# EAGLE design Adafruit BrainCraft HAT (EAGLE 9.6.2)

## Sheet 1 of 3: I2S Audio
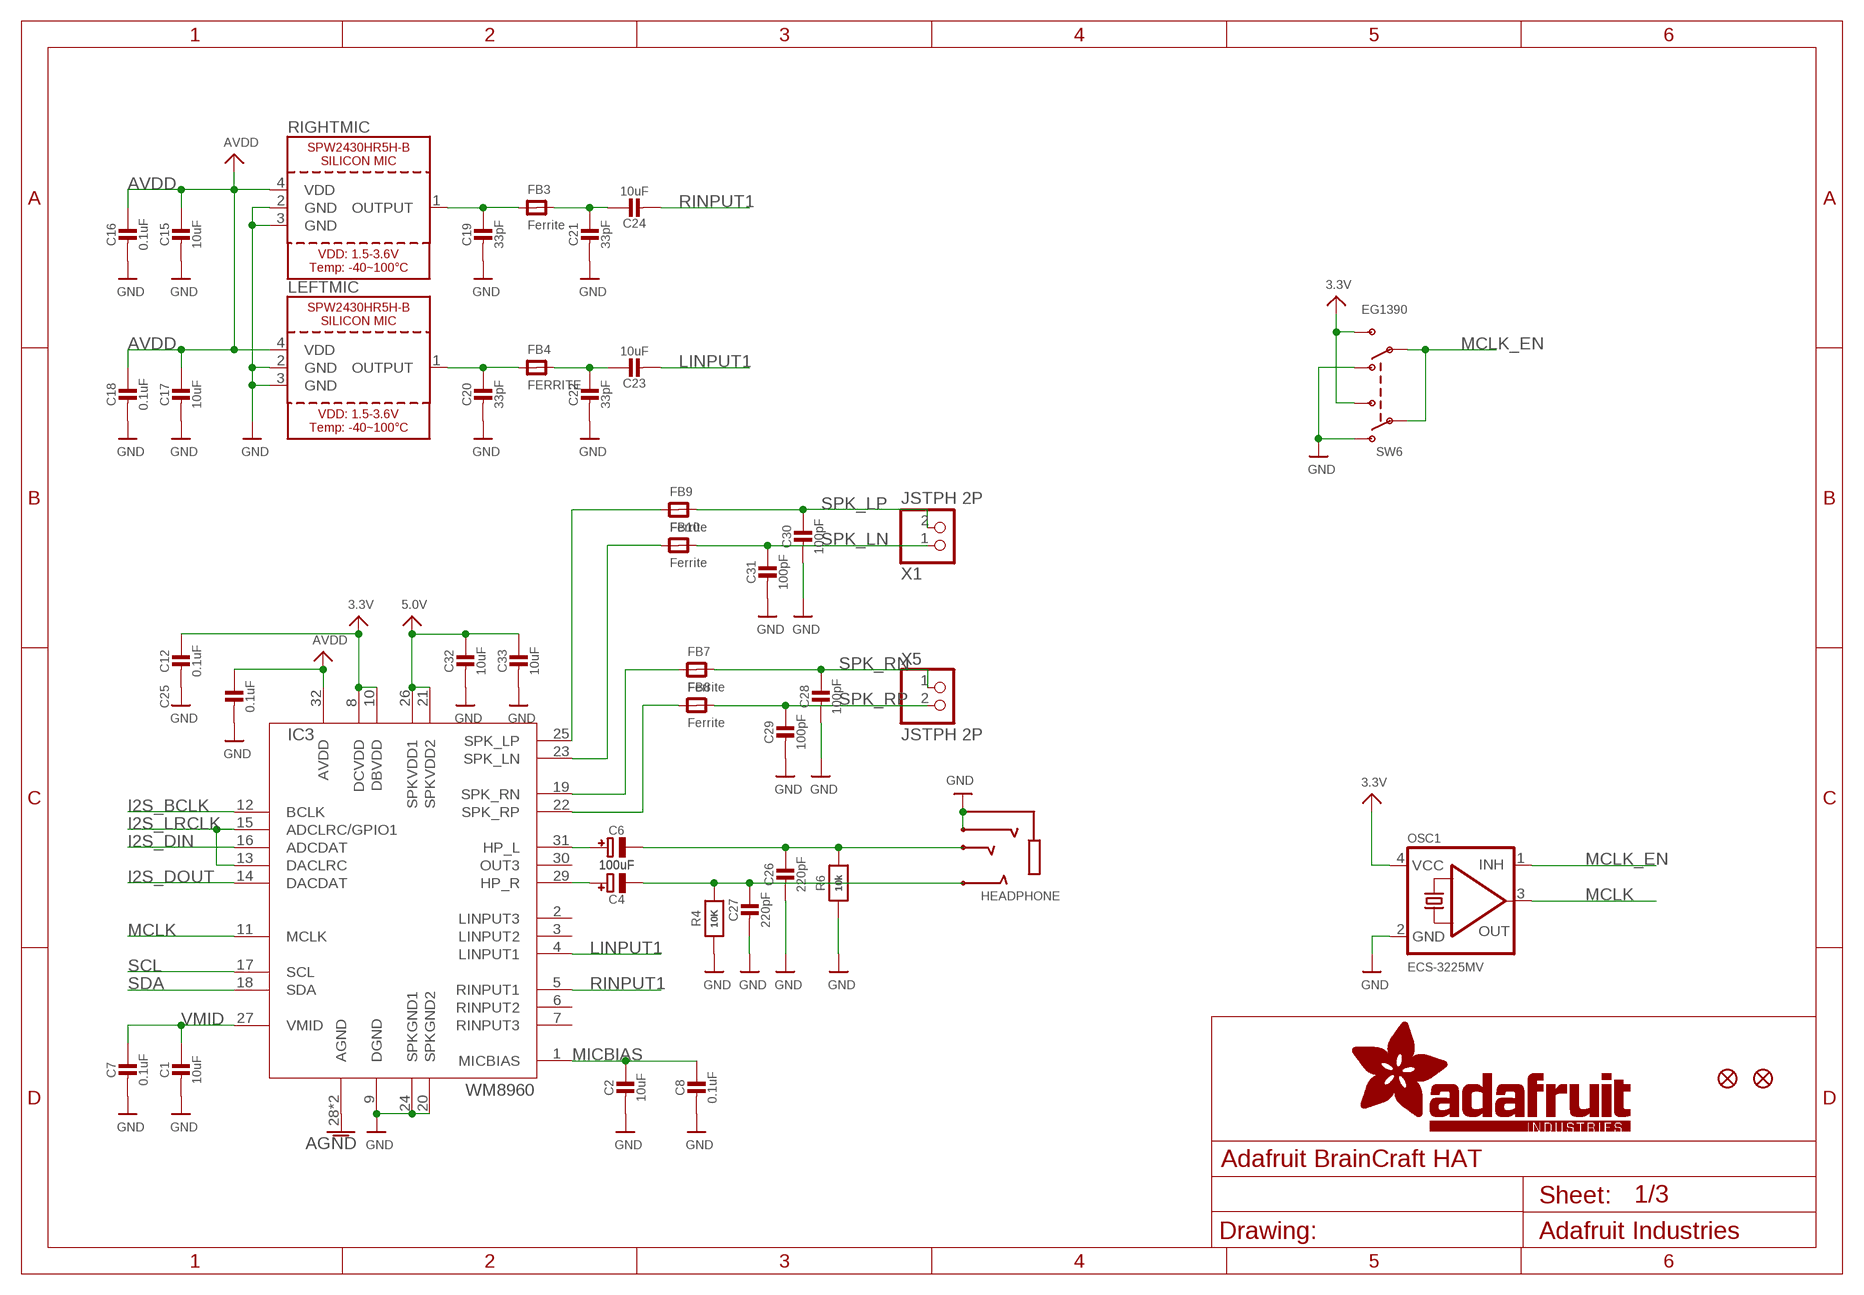
[diagram p0: schematic, sheet 1]

### Parts
C1  10uF  CAP_CERAMIC0805-NOOUTLINE  [0805-NO]
C2  10uF  CAP_CERAMIC0805-NOOUTLINE  [0805-NO]
C4  100uF  CAP_ELECTROLYTICPANASONIC_C  [PANASONIC_C]
C6  100uF  CAP_ELECTROLYTICPANASONIC_C  [PANASONIC_C]
C7  0.1uF  CAP_CERAMIC0603_NO  [0603-NO]
C8  0.1uF  CAP_CERAMIC0603_NO  [0603-NO]
C12  0.1uF  CAP_CERAMIC0603_NO  [0603-NO]
C15  10uF  CAP_CERAMIC0805-NOOUTLINE  [0805-NO]
C16  0.1uF  CAP_CERAMIC0603_NO  [0603-NO]
C17  10uF  CAP_CERAMIC0805-NOOUTLINE  [0805-NO]
C18  0.1uF  CAP_CERAMIC0603_NO  [0603-NO]
C19  33pF  CAP_CERAMIC0603_NO  [0603-NO]
C20  33pF  CAP_CERAMIC0603_NO  [0603-NO]
C21  33pF  CAP_CERAMIC0603_NO  [0603-NO]
C22  33pF  CAP_CERAMIC0603_NO  [0603-NO]
C23  10uF  CAP_CERAMIC0805-NOOUTLINE  [0805-NO]
C24  10uF  CAP_CERAMIC0805-NOOUTLINE  [0805-NO]
C25  0.1uF  CAP_CERAMIC0603_NO  [0603-NO]
C26  220pF  CAP_CERAMIC0603_NO  [0603-NO]
C27  220pF  CAP_CERAMIC0603_NO  [0603-NO]
C28  100pF  CAP_CERAMIC0603_NO  [0603-NO]
C29  100pF  CAP_CERAMIC0603_NO  [0603-NO]
C30  100pF  CAP_CERAMIC0603_NO  [0603-NO]
C31  100pF  CAP_CERAMIC0603_NO  [0603-NO]
C32  10uF  CAP_CERAMIC0805-NOOUTLINE  [0805-NO]
C33  10uF  CAP_CERAMIC0805-NOOUTLINE  [0805-NO]
FB3  Ferrite  FERRITE-0805NO  [0805-NO]
FB4  FERRITE  FERRITE-0805NO  [0805-NO]
FB7  Ferrite  FERRITE-0805NO  [0805-NO]
FB8  Ferrite  FERRITE-0805NO  [0805-NO]
FB9  Ferrite  FERRITE-0805NO  [0805-NO]
FB10  Ferrite  FERRITE-0805NO  [0805-NO]
FID1  FIDUCIAL_1MM  [FIDUCIAL_1MM]
FID2  FIDUCIAL_1MM  [FIDUCIAL_1MM]
HEADPHONE  AUDIO_3.5MMJACK_4POL  [4UCONN_18510]
IC3  WM8960  [QFN32_5MM]
LEFTMIC  SPW2430HR5H-B  [SPW2430HR5H-B]
OSC1  ECS-3225MV  OSCILLATOR3.2X2.5  [OSC_3.2X2.5MM]
R4  10K  RESISTOR_0603_NOOUT  [0603-NO]
R6  10k  RESISTOR_0603_NOOUT  [0603-NO]
RIGHTMIC  SPW2430HR5H-B  [SPW2430HR5H-B]
SW6  EG1390  SWITCH_DPDTEG1390  [EG1390]
X1  JSTPH 2P  CON_JST_PH_2PIN  [JSTPH2]
X5  JSTPH 2P  CON_JST_PH_2PIN  [JSTPH2]

### Nets
3.3V: C12.1 IC3.8(DCVDD) IC3.10(DBVDD) OSC1.4(VCC) SW6.S1 SW6.S2 ; also sheet 2,3
5.0V: C32.1 C33.1 IC3.21(SPKVDD2) IC3.26(SPKVDD1) ; also sheet 2,3
AGND: IC3.28(AGND) IC3.33(AGND) ; also sheet 3
AVDD: C15.1 C16.1 C17.1 C18.1 C25.1 IC3.32(AVDD) LEFTMIC.4(VDD) RIGHTMIC.4(VDD) ; also sheet 3
GND: C1.2 C2.2 C7.2 C8.2 C12.2 C15.2 C16.2 C17.2 C18.2 C19.2 C20.2 C21.2 C22.2 C25.2 C26.2 C27.2 C28.2 C29.2 C30.2 C31.2 C32.2 C33.2 HEADPHONE.1-GND(TIP) HEADPHONE.4-INNER_SLEEVE(RING1) IC3.9(DGND) IC3.20(SPKGND2) IC3.24(SPKGND1) LEFTMIC.2(GND) LEFTMIC.3(GND) OSC1.2(GND) R4.1 R6.1 RIGHTMIC.2(GND) RIGHTMIC.3(GND) SW6.O1 SW6.O2 ; also sheet 2,3
I2S_BCLK: IC3.12(BCLK) ; also sheet 3
I2S_DIN: IC3.16(ADCDAT) ; also sheet 3
I2S_DOUT: IC3.14(DACDAT) ; also sheet 3
I2S_LRCLK: IC3.13(DACLRC) IC3.15(ADCLRC/GPIO1) ; also sheet 3
LINPUT1: C23.2 IC3.4(LINPUT1)
MCLK: IC3.11(MCLK) OSC1.3(OUT)
MCLK_EN: OSC1.1(INH) SW6.P1 SW6.P2
MICBIAS: C2.1 C8.1 IC3.1(MICBIAS)
N$1: FB7.1 IC3.19(SPK_RN)
N$2: FB8.1 IC3.22(SPK_RP)
N$3: C6.+ IC3.31(HP_L)
N$5: C4.+ IC3.29(HP_R)
N$9: C4.- C27.1 HEADPHONE.3-OUTER_SLEEVE(RING2) R4.2
N$10: C6.- C26.1 HEADPHONE.2-TIP(RING3) R6.2
N$12: C19.1 FB3.1 RIGHTMIC.1(OUTPUT)
N$13: C20.1 FB4.1 LEFTMIC.1(OUTPUT)
N$16: C21.1 C24.1 FB3.2
N$17: C22.1 C23.1 FB4.2
N$21: FB9.1 IC3.25(SPK_LP)
N$22: FB10.1 IC3.23(SPK_LN)
RINPUT1: C24.2 IC3.5(RINPUT1)
SCL: IC3.17(SCL) ; also sheet 2,3
SDA: IC3.18(SDA) ; also sheet 2,3
SPK_LN: C31.1 FB10.2 X1.1
SPK_LP: C30.1 FB9.2 X1.2
SPK_RN: C28.1 FB7.2 X5.1
SPK_RP: C29.1 FB8.2 X5.2
VMID: C1.1 C7.1 IC3.27(VMID)
Unconnected: IC3.2(LINPUT3) IC3.3(LINPUT2) IC3.6(RINPUT2) IC3.7(RINPUT3) IC3.30(OUT3)

## Sheet 2 of 3: TFT Display and UI
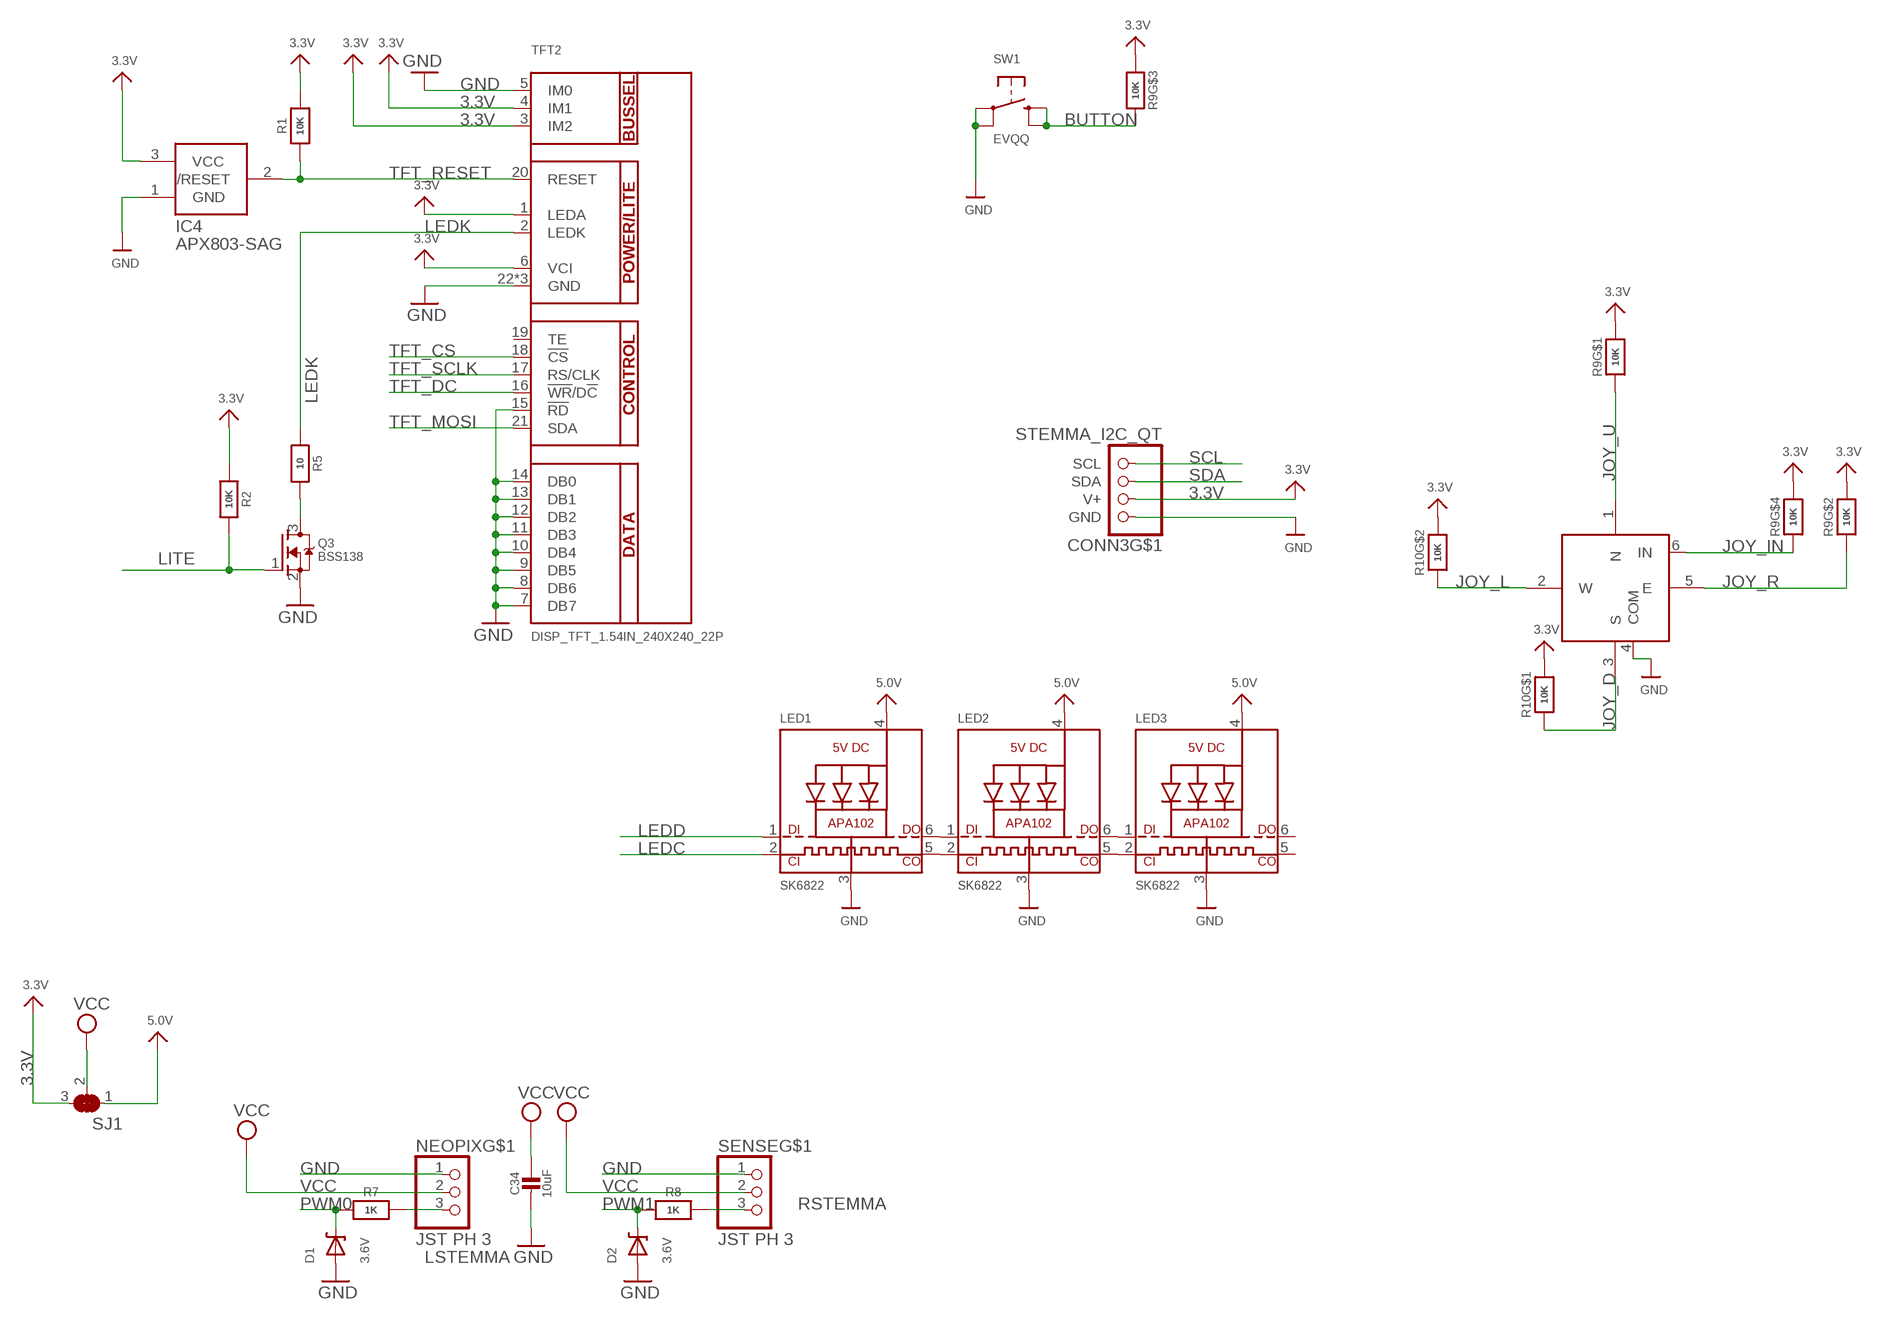
[diagram p1: schematic, sheet 2]

### Parts
C34  10uF  CAP_CERAMIC0805-NOOUTLINE  [0805-NO]
CONN3  STEMMA_I2C_QT  [JST_SH4]
D1  3.6V  DIODE-ZENERSOD323  [SOD-323]
D2  3.6V  DIODE-ZENERSOD323  [SOD-323]
IC4  APX803-SAG  AXP083-SAG  [SOT23]
LED1  SK6822  APA102  [APA102]
LED2  SK6822  APA102  [APA102]
LED3  SK6822  APA102  [APA102]
NEOPIX  JST PH 3  CON_JST_PH_3PIN  [JSTPH3]
Q3  BSS138  MOSFET-NWIDE  [SOT23-WIDE]
R1  10K  RESISTOR_0603_NOOUT  [0603-NO]
R2  10K  RESISTOR_0603_NOOUT  [0603-NO]
R5  10  RESISTOR_0603_NOOUT  [0603-NO]
R7  1K  RESISTOR_0603_NOOUT  [0603-NO]
R8  1K  RESISTOR_0603_NOOUT  [0603-NO]
R9  10K  RESISTOR_4PACK  [RESPACK_4X0603]
R10  10K  RESISTOR_4PACK  [RESPACK_4X0603]
SENSE  JST PH 3  CON_JST_PH_3PIN  [JSTPH3]
SJ1  SOLDERJUMPER_2WAY  [SOLDERJUMPER_2WAY_OPEN_NOPASTE]
SW1  EVQQ  SWITCH_TACT_SMT_EVQQ2_SMALL  [EVQ-Q2_SMALLER]
SW5  NAVSWITCHSKQUABAUE010  [SKQUBAE010]
TFT2  DISP_TFT_1.54IN_240X240_22P  [TFT_1.54IN_240X240_22PIN]

### Nets
3.3V: CONN3.2(V+) IC4.3(VCC) R1.2 R2.2 R9.5 R9.6 R9.7 R9.8 R10.7 R10.8 SJ1.3 TFT2.1(LEDA) TFT2.3(IM2) TFT2.4(IM1) TFT2.6(VCI) ; also sheet 1,3
5.0V: LED1.4(VDD) LED2.4(VDD) LED3.4(VDD) SJ1.1 ; also sheet 1,3
BUTTON: R9.3 SW1.B'(S1) SW1.B(S) ; also sheet 3
GND: C34.2 CONN3.1(GND) D1.A D2.A IC4.1(GND) LED1.3(GND) LED2.3(GND) LED3.3(GND) NEOPIX.1 Q3.2(S) SENSE.1 SW1.A'(P1) SW1.A(P) SW5.4(COM) TFT2.5(IM0) TFT2.7(DB7) TFT2.8(DB6) TFT2.9(DB5) TFT2.10(DB4) TFT2.11(DB3) TFT2.12(DB2) TFT2.13(DB1) TFT2.14(DB0) TFT2.15(!RD) TFT2.22(GND) TFT2.SUPPORT1(GND) TFT2.SUPPORT2(GND) ; also sheet 1,3
JOY_D: R10.1 SW5.3(S) ; also sheet 3
JOY_IN: R9.4 SW5.6(IN) ; also sheet 3
JOY_L: R10.2 SW5.2(W) ; also sheet 3
JOY_R: R9.2 SW5.5(E) ; also sheet 3
JOY_U: R9.1 SW5.1(N) ; also sheet 3
LEDC: LED1.2(CKI) ; also sheet 3
LEDD: LED1.1(DI) ; also sheet 3
LEDK: R5.2 TFT2.2(LEDK)
LITE: Q3.1(G) R2.1 ; also sheet 3
LSTEMMA: NEOPIX.3 R7.1
N$4: Q3.3(D) R5.1
N$7: LED1.6(DO) LED2.1(DI)
N$11: LED1.5(CKO) LED2.2(CKI)
N$14: LED2.6(DO) LED3.1(DI)
N$15: LED2.5(CKO) LED3.2(CKI)
PWM0: D1.C R7.2 ; also sheet 3
PWM1: D2.C R8.2 ; also sheet 3
RSTEMMA: R8.1 SENSE.3
SCL: CONN3.4(SCL) ; also sheet 1,3
SDA: CONN3.3(SDA) ; also sheet 1,3
TFT_CS: TFT2.18(!CS) ; also sheet 3
TFT_DC: TFT2.16(!WR!/D!C) ; also sheet 3
TFT_MOSI: TFT2.21(SDA) ; also sheet 3
TFT_RESET: IC4.2(/RESET) R1.1 TFT2.20(RESET)
TFT_SCLK: TFT2.17(RS/CLK) ; also sheet 3
VCC [power]: C34.1 NEOPIX.2 SENSE.2 SJ1.2
Unconnected: CONN3.MT1(MT) CONN3.MT2(MT) LED3.5(CKO) LED3.6(DO) NEOPIX.NC1(MT) NEOPIX.NC2(MT) R10.3 R10.4 R10.5 R10.6 SENSE.NC1(MT) SENSE.NC2(MT) TFT2.19(TE)

## Sheet 3 of 3: RasPi Hat & Power
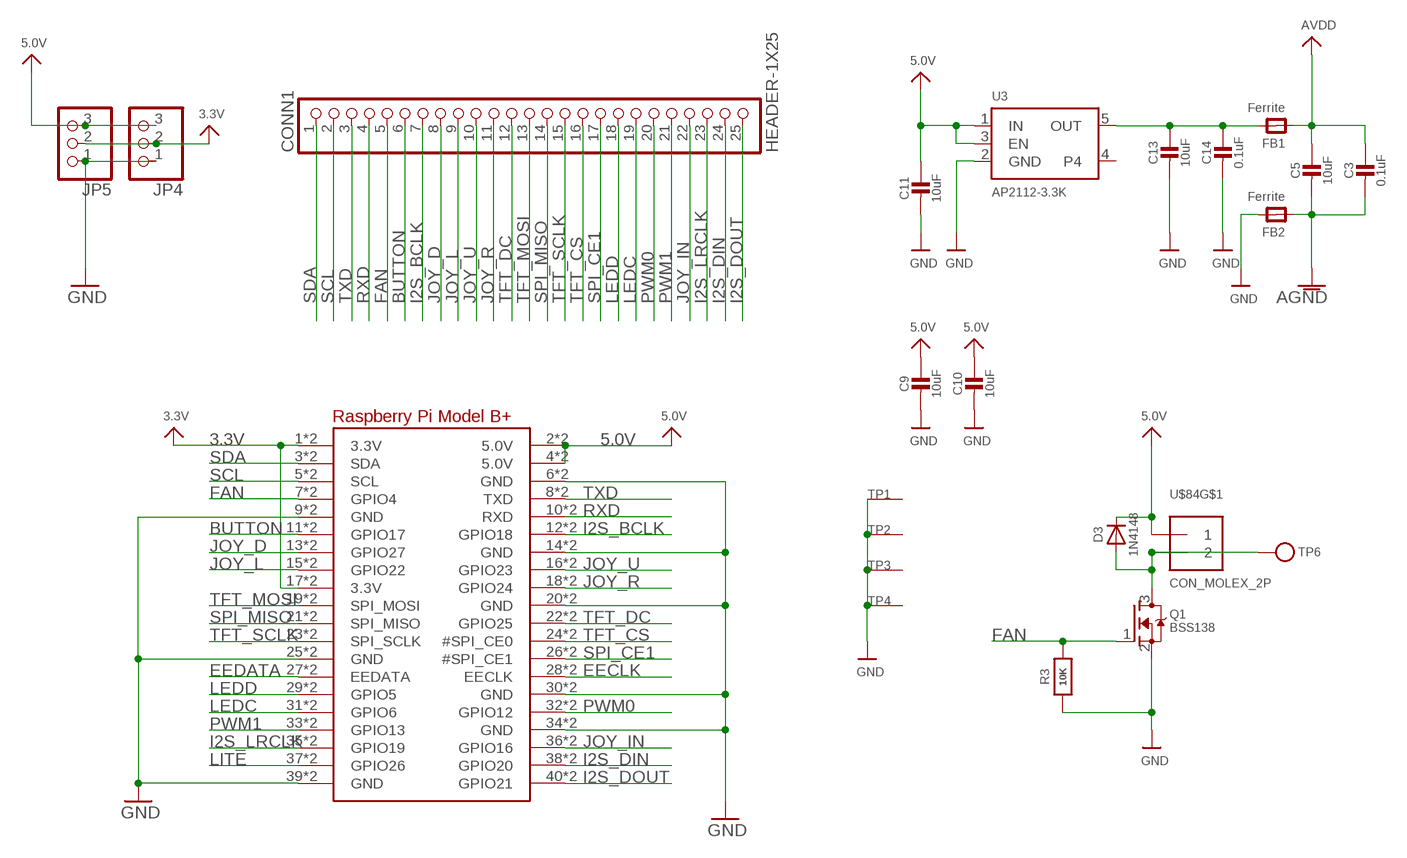
[diagram p2: schematic, sheet 3]

### Parts
C3  0.1uF  CAP_CERAMIC0603_NO  [0603-NO]
C5  10uF  CAP_CERAMIC0805-NOOUTLINE  [0805-NO]
C9  10uF  CAP_CERAMIC0805-NOOUTLINE  [0805-NO]
C10  10uF  CAP_CERAMIC0805-NOOUTLINE  [0805-NO]
C11  10uF  CAP_CERAMIC0805-NOOUTLINE  [0805-NO]
C13  10uF  CAP_CERAMIC0805-NOOUTLINE  [0805-NO]
C14  0.1uF  CAP_CERAMIC0603_NO  [0603-NO]
CONN1  HEADER-1X25  [1X25_ROUND_70MIL]
D3  1N4148  DIODESOD-323  [SOD-323]
FB1  Ferrite  FERRITE0805  [0805]
FB2  Ferrite  FERRITE0805  [0805]
JP4  HEADER-1X376MIL  [1X03_ROUND_76]
JP5  HEADER-1X376MIL  [1X03_ROUND_76]
Q1  BSS138  MOSFET-NWIDE  [SOT23-WIDE]
R3  10K  RESISTOR_0603_NOOUT  [0603-NO]
RPI1  RASPBERRYPI_BPLUS_HAT_SMTTHM_SLOTS  [PI_HAT_SMTTHM_SLOTS]
TP1  SEWTAP_SMTNUTM3  [SMT_NUT_3MM]
TP2  SEWTAP_SMTNUTM3  [SMT_NUT_3MM]
TP3  SEWTAP_SMTNUTM3  [SMT_NUT_3MM]
TP4  SEWTAP_SMTNUTM3  [SMT_NUT_3MM]
TP6  TESTPOINTROUND2MM  [TESTPOINT_ROUND_2MM]
U3  AP2112-3.3K  VREG_SOT23-5  [SOT23-5]
U$84  CON_MOLEX_2P  [53398-0271]

### Nets
3.3V: JP4.2 JP5.2 RPI1.1(3.3V) RPI1.17(3.3V) RPI1.S1(3.3V) RPI1.S17(3.3V) ; also sheet 1,2
5.0V: C9.1 C10.1 C11.1 D3.C JP4.3 JP5.3 RPI1.2(5.0V) RPI1.4(5.0V) RPI1.S2(5.0V) RPI1.S4(5.0V) U3.1(IN) U3.3(EN) U$84.1 ; also sheet 1,2
AGND: C3.2 C5.2 FB2.1 ; also sheet 1
AVDD: C3.1 C5.1 FB1.1 ; also sheet 1
BUTTON: CONN1.6 RPI1.11(GPIO17) RPI1.S11(GPIO17) ; also sheet 2
EECLK: RPI1.28(EECLK) RPI1.S28(EECLK)
EEDATA: RPI1.27(EEDATA) RPI1.S27(EEDATA)
FAN: CONN1.5 Q1.1(G) R3.1 RPI1.7(GPIO4) RPI1.S7(GPIO4)
GND: C9.2 C10.2 C11.2 C13.2 C14.2 FB2.2 JP4.1 JP5.1 Q1.2(S) R3.2 RPI1.6(GND) RPI1.9(GND) RPI1.14(GND) RPI1.20(GND) RPI1.25(GND) RPI1.30(GND) RPI1.34(GND) RPI1.39(GND) RPI1.S6(GND) RPI1.S9(GND) RPI1.S14(GND) RPI1.S20(GND) RPI1.S25(GND) RPI1.S30(GND) RPI1.S34(GND) RPI1.S39(GND) TP1.P$1(SEW) TP2.P$1(SEW) TP3.P$1(SEW) TP4.P$1(SEW) U3.2(GND) ; also sheet 1,2
I2S_BCLK: CONN1.7 RPI1.12(GPIO18) RPI1.S12(GPIO18) ; also sheet 1
I2S_DIN: CONN1.24 RPI1.38(GPIO20) RPI1.S38(GPIO20) ; also sheet 1
I2S_DOUT: CONN1.25 RPI1.40(GPIO21) RPI1.S40(GPIO21) ; also sheet 1
I2S_LRCLK: CONN1.23 RPI1.35(GPIO19) RPI1.S35(GPIO19) ; also sheet 1
JOY_D: CONN1.8 RPI1.13(GPIO27) RPI1.S13(GPIO27) ; also sheet 2
JOY_IN: CONN1.22 RPI1.36(GPIO16) RPI1.S36(GPIO16) ; also sheet 2
JOY_L: CONN1.9 RPI1.15(GPIO22) RPI1.S15(GPIO22) ; also sheet 2
JOY_R: CONN1.11 RPI1.18(GPIO24) RPI1.S18(GPIO24) ; also sheet 2
JOY_U: CONN1.10 RPI1.16(GPIO23) RPI1.S16(GPIO23) ; also sheet 2
LEDC: CONN1.19 RPI1.31(GPIO6) RPI1.S31(GPIO6) ; also sheet 2
LEDD: CONN1.18 RPI1.29(GPIO5) RPI1.S29(GPIO5) ; also sheet 2
LITE: RPI1.37(GPIO26) RPI1.S37(GPIO26) ; also sheet 2
N$19: D3.A Q1.3(D) TP6.P$1 U$84.2
OUT: C13.1 C14.1 FB1.2 U3.5(OUT)
PWM0: CONN1.20 RPI1.32(GPIO12) RPI1.S32(GPIO12) ; also sheet 2
PWM1: CONN1.21 RPI1.33(GPIO13) RPI1.S33(GPIO13) ; also sheet 2
RXD: CONN1.4 RPI1.10(RXD) RPI1.S10(RXD)
SCL: CONN1.2 RPI1.5(SCL) RPI1.S5(SCL) ; also sheet 1,2
SDA: CONN1.1 RPI1.3(SDA) RPI1.S3(SDA) ; also sheet 1,2
SPI_CE1: CONN1.17 RPI1.26(#SPI_CE1) RPI1.S26(#SPI_CE1)
SPI_MISO: CONN1.14 RPI1.21(SPI_MISO) RPI1.S21(SPI_MISO)
TFT_CS: CONN1.16 RPI1.24(#SPI_CE0) RPI1.S24(#SPI_CE0) ; also sheet 2
TFT_DC: CONN1.12 RPI1.22(GPIO25) RPI1.S22(GPIO25) ; also sheet 2
TFT_MOSI: CONN1.13 RPI1.19(SPI_MOSI) RPI1.S19(SPI_MOSI) ; also sheet 2
TFT_SCLK: CONN1.15 RPI1.23(SPI_SCLK) RPI1.S23(SPI_SCLK) ; also sheet 2
TXD: CONN1.3 RPI1.8(TXD) RPI1.S8(TXD)
Unconnected: U3.4 U$84.M1(MT) U$84.M2(MT)

## Library data of the parts
C1-C3 C5 C7-C34 = microbuilder:CAP_CERAMIC: Ceramic Capacitors For new designs, use the packages preceded by an '_' character since they are more reliable: The following footprints should be used on most boards: _0402 - Standard footprint for regular board layouts _0603 - Standard footprint for regular board layouts _0805 - Standard footprint for regular board layouts _1206 - Standard footprint for regular board layouts For extremely tight-pitch boards where space is at a premium, the following 'micro-pitch' footprints can be used (smaller pads, no silkscreen outline, etc.): _0402MP - Micro-pitch footprint for very dense/compact boards _0603MP - Micro-pitch footprint for very dense/compact boards _0805MP - Micro-pitch footprint for very dense/compact boards _1206MP - Micro-pitch footprint for very dense/compact boards
C4 C6 = microbuilder:CAP_ELECTROLYTIC: Electrolytic Capacitors SMT PANASONIC_C - Size C Panasonic Electrolytic Aluminum Capacitor 47µF 16V 20% Electrolytic Capacitor [Digikey: PCE3890TR-ND] PANASONIC_D - Size D Panasonic Electrolytic Aluminum Capacitor 100µF 25V 20% Electrolytic Capacitor [Digikey: PCE3898TR-ND] PTH 3.5 mm grid, 8 mm diameter ... 3.5 mm grid, 10 mm diameter ...
CONN1 = microbuilder:HEADER-1X25
CONN3 = microbuilder:STEMMA_I2C
D1 D2 = microbuilder:DIODE-ZENER: Zener Diode SMA: 30V 1W Zener Diode, 1.2Vf - Digikey: SMAZ30-FDICT-ND
D3 = microbuilder:DIODE: Diode SMA Model Volts Amps Type Vf Ir Digikey # Notes SSA34-E3 40V 3A Schottky 480mV @ 3A 200uA @ 40V SSA34-E3/61TGITR-ND CDBA120-G 20V 1A Schottky 500mV @ 1A 500uA @ 20V 641-1014-6-ND REEL MBRA210 10V 2A Schottky 350mV @ 2A 700uA @ 10V MBRA210LT3 SOD-123 Model Volts Amps Type Vf Ir Order # Notes BAT54T1G 30V 200mA Schottky 800mV @ 200mA 2uA @ 25V BAT54T1GOSTR-ND B0530W 30V 500mA Schottky 430mV @ 500mA 130uA @ 30V B0530W-FDICT-ND REEL MBR120 20V 1A Schottky 340mV @ 1A MBR120VLSFT1GOSCT-ND SOD-323 Model Volts Amps Type Vf Ir Order # Notes PMEG2005EJ 20V 500mA Schottky 355mV @ 500mA 568-4110-1-ND ZLLS410 10V 570mA Schottky 380mV @ 570mA ZLLS410CT-ND 1N4148WS 75V 150mA Silicon/Simple 1V 1N4148WSFSCT-ND REEL SOD-523 Model Volts Amps Type Vf Ir Order # Notes BAT54XV2 30V 200mA Schottky 0.8V @ 100mA BAT54XV2CT-ND TB751S 30V 30mA Schottky RB751S-40TE61CT-ND SOT23-R/W (R = Solder Paste/Reflow Ovens, W = Hand-Soldering) Model Volts Amps Type Vf Ir Order # Notes BAT54FILM 40V 300mA Schottky 497-7162-1-ND POWERDI-5 Model Volts Amps Type Vf Ir Order # Notes PDS560 60V 5A Schottky 670mV @ 5A 150uA @ 60V PDS560DICT-ND
FB1-FB4 FB7-FB10 = microbuilder:FERRITE: Ferrite Bead 0603 MMZ1608B121C - 120 Ohm @ 100MHz, 600mA, 0.15 Ohm DC Resistance - Digikey: 445-2164-1-ND BK1608HW121-T - 120 Ohm, 600mA Ferrite Chip - Digikey: 587-1876-2-ND 0805 HZ0805B272R-10 - 2.7K Ohm @ 100MHz, 200mA, 0.8 Ohm DC Resistance - Digikey: 240-2504-1-ND (see also Murata BLM21BD272SN1L) MMZ2012Y152B - 1.5K Ohm @ 100MHz, 500mA, 0.4 Ohm DC Resistance - Digikey: 445-1560-1-ND - Mainly for high frequency (80-400MHz) MMZ2012R102A - 1K Ohm @ 100MHz, 500mA, 0.3 Ohm DC Resistance - Digikey: 445-1555-2-ND - More general purpose (10-200MHz)
FID1 FID2 = microbuilder:FIDUCIAL: Fiducial Alignment Points Various fiducial points for machine vision alignment.; BOM: EXCLUDE
HEADPHONE = microbuilder:AUDIO_3.5MMJACK_4POL: Footprint courtesy Morten Hjerde (Riftlabs.com) These are normally connected as follows (4-pin 3.5mm 'TRRS'), from left-to right on the schematic symbol above: Tip: Left Audio Outermost Ring: Right Audio Innermost Ring: Common/GND Shell: Mic+
IC3 = microbuilder:WM8960
IC4 = adafruit:AXP083
JP4 JP5 = microbuilder:HEADER-1X3: PIN HEADER
LED1-LED3 = microbuilder:APA102: APA102/DotStar Pixels VCC: 5V DC Refresh Rate: 400Hz
LEFTMIC RIGHTMIC = microbuilder:SPW2430HR5H-B: SPW2430HR5H-B - Silicon Microphone
NEOPIX SENSE = microbuilder:CON_JST_PH_3PIN
OSC1 = microbuilder:OSCILLATOR: Oscillators 3.2x2.5mm SMT 4.0MHz +/- 50ppm, 3.3V, 9mA, -40/+85°C - Digikey: 535-9752-1-ND 50MHz +/- 50ppm, 3.3V, 8mA, -10/+70°C - Digikey: 478-4792-1-ND 5x7mm SMT 4.0MHz +/-20ppm 3.3V, 20mA, -20/+70°C - Digikey: 535-9329-2-ND 50MHz +/- 25ppm 3.3V, 35mA, -40/+85°C - Digikey: 631-1197-1-ND
Q1 Q3 = microbuilder:MOSFET-N: N-Channel Mosfet LEGEND VDS: Voltage Drain-Source ID: Drain Current RDS(ON): Drain-Source On-State Resistance VGS(TH): Gate-Source Threshold Voltage CISS: Drain-Source Input Capacitance SOT-23 Name VDS ID RDS(ON) VGS(TH) CISS Order Number 2N7002E 60V 260mA 2.5 Ohm 2.5V @ 250uA 26.7pF @ 25V 2N7002ET1GOSTR-ND BSH103 30V 850mA 400 mOhm 400mV @ 1mA 83pF @ 24V BSH103,235-ND BSS138 60V 320mA 1.6 Ohm 1.5V @ 250uA 50pF @ 10V Mouser: 771-BSS138PW115 DMN2075U-7 20V 4.2A 38 mOhm 1V @ 250 uA 594.3pF @ 10V DMN2075U-7DICT-ND * BSS138 good choice for I2C level-shifting POWERPAK 1212-8 Name VDS ID RDS(ON) VGS(TH) CISS Order Number Si7308DN 60V 6A 58 mOhm 3V @ 250uA 665pF @ 15V SI7308DN-T1-E3CT-ND
R1-R8 = microbuilder:RESISTOR: Resistors For new designs, use the packages preceded by an '_' character since they are more reliable: The following footprints should be used on most boards: _0402 - Standard footprint for regular board layouts _0603 - Standard footprint for regular board layouts _0805 - Standard footprint for regular board layouts _1206 - Standard footprint for regular board layouts For extremely tight-pitch boards where space is at a premium, the following 'micro-pitch' footprints can be used (smaller pads, no silkscreen outline, etc.): _0402MP - Micro-pitch footprint for very dense/compact boards _0603MP - Micro-pitch footprint for very dense/compact boards _0805MP - Micro-pitch footprint for very dense/compact boards _1206MP - Micro-pitch footprint for very dense/compact boards
R9 R10 = microbuilder:RESISTOR_4PACK: Resistor Packs (4 resistors) 4 x 0603 10K 1/16W - Digikey: YC164J-10KCT-ND
RPI1 = adafruit_sbc:RASPBERRYPI_BPLUS
SJ1 = microbuilder:SOLDERJUMPER_2WAY: 2-Way Solder Jumper
SW1 = microbuilder:SWITCH_TACT_SMT: SMT Tact Switches 6x6mm - Digikey: P12940SCT-ND KMR2 (4.6x2.8mm) - Digikey: 401-1426-1-ND EVQ-PQHB55 - Light Touch, 160GF (4.5x4.5mm) - Digikey: P8090SCT-ND KMT0 - KMT021 NGJ LHS (etc.) IP68/Waterproof - Digikey: CKN10289CT-ND
SW5 = microbuilder:NAVSWITCH
SW6 = microbuilder:SWITCH_DPDT: Switch - DPDT A DPDT Switch acts like an SPDT switch, but has a pair of switches instead of just one. Vertical - 0.3A @ 6V SMT - Digikey: JS202011SCQN
TFT2 = adafruit_display:DISP_TFT_1.54IN_240X240_22P
TP1-TP4 = microbuilder:SEWTAP
TP6 = microbuilder:TESTPOINT: Test Point Various test points for characterisation and PCB testing TESTPOINT_SMT - Compact Surface Mount Test Point [Digikey: 5016KTR-ND]
U3 = microbuilder:VREG_SOT23-5: SOT23-5 Fixed Voltage Regulators Part Current Out V Out V In V Dropout θJA (°C/W) TJ (°C) Digikey Part No. ADP121 150mA 3.3V 3.4-5.5V 0.09V @ 150mA -- -- ADP121-AUJZ33R7CT-ND ADP121 150mA 3.0V 3.1-5.5V 0.09V @ 150mA -- -- ADP121-AUJZ30R7CT-ND ADP122 300mA 3.3V 3.4-5.5V 0.085V @ 300mA -- -- ADP122AUJZ-3.3-R7CT-ND ADP1712 300mA 3.3V 3.5-5.5V 0.17V @ 300mA -- -- ADP1712AUJZ-3.3-R7TR-ND AP7311 (Low Cost) 150mA 3.3V 3.5-6V 0.15V @ 150mA -- -- AP7311-33WG-7DICT-ND LD39015M18R 150mA 1.8V 1.9V-5.5V 0.08V @ 100mA -- -- 497-6977-1-ND LP2985A-33DBVR 150mA 3.3V 3.3-16V 0.28V @ 150mA 206 150 296-18479-1-ND MCP1824T-3302E/OT 300mA 3.3V 3.5V-6V 0.2V @ 300mA -- -- MCP1824T-3302E/OTCT-ND MIC5205-2.5YM5 TR 150mA 2.5V 2.7-16V 0.165V @ 150mA -- -- 576-1257-2-ND MIC5205-3.0YM5 TR 150mA 3.0V 3.2V-16V 0.165V @ 150mA -- -- 576-1258-2-ND MIC5205-3.3YM5 TR 150mA 3.3V 3.5V-16V 0.165V @ 150mA -- -- 576-1259-2-ND TPS780330220 150mA 3.3V+2.2V 3.6-5.5V 250mV Max -- -- 296-23332-1-ND TDA3663/N1,135 100mA 3.3V 3.5-45V 0.18V @ 50mA -- -- 568-5343-1-ND Max operating temp can be calculated using θJA, TJ (max junction temperature), and power in watts. Set the "Maximum Ambient Temperature" until it reaches TJ ("Max Junction Temperature"), which is the absolute limit for safe use of the regulator: Heat Sink Temperature Calculator <http://www.daycounter.com/Calculators/Heat-Sink-Temperature-Calculator.phtml> For example, With 12V source into a 3.3V LP2985 and a 30mA load, we are dissipating (12V-3.3V) * 0.03A = 0.261W. With a θJA of 206 °C/W, a TJ of 150°C, and 261mW we can safely use the chip without a heat sink up to 75°C (=147.1°C Junction Temperature).
U$84 = microbuilder:CON_MOLEX_2P
X1 X5 = microbuilder:CON_JST_PH_2PIN: JST 2-Pin Right-Angle Connector PH-Series - 4UConnector: 17311 SH-Series - 4UConnector: 07278

## Net classes
1 power: width 0.305 mm

## Board
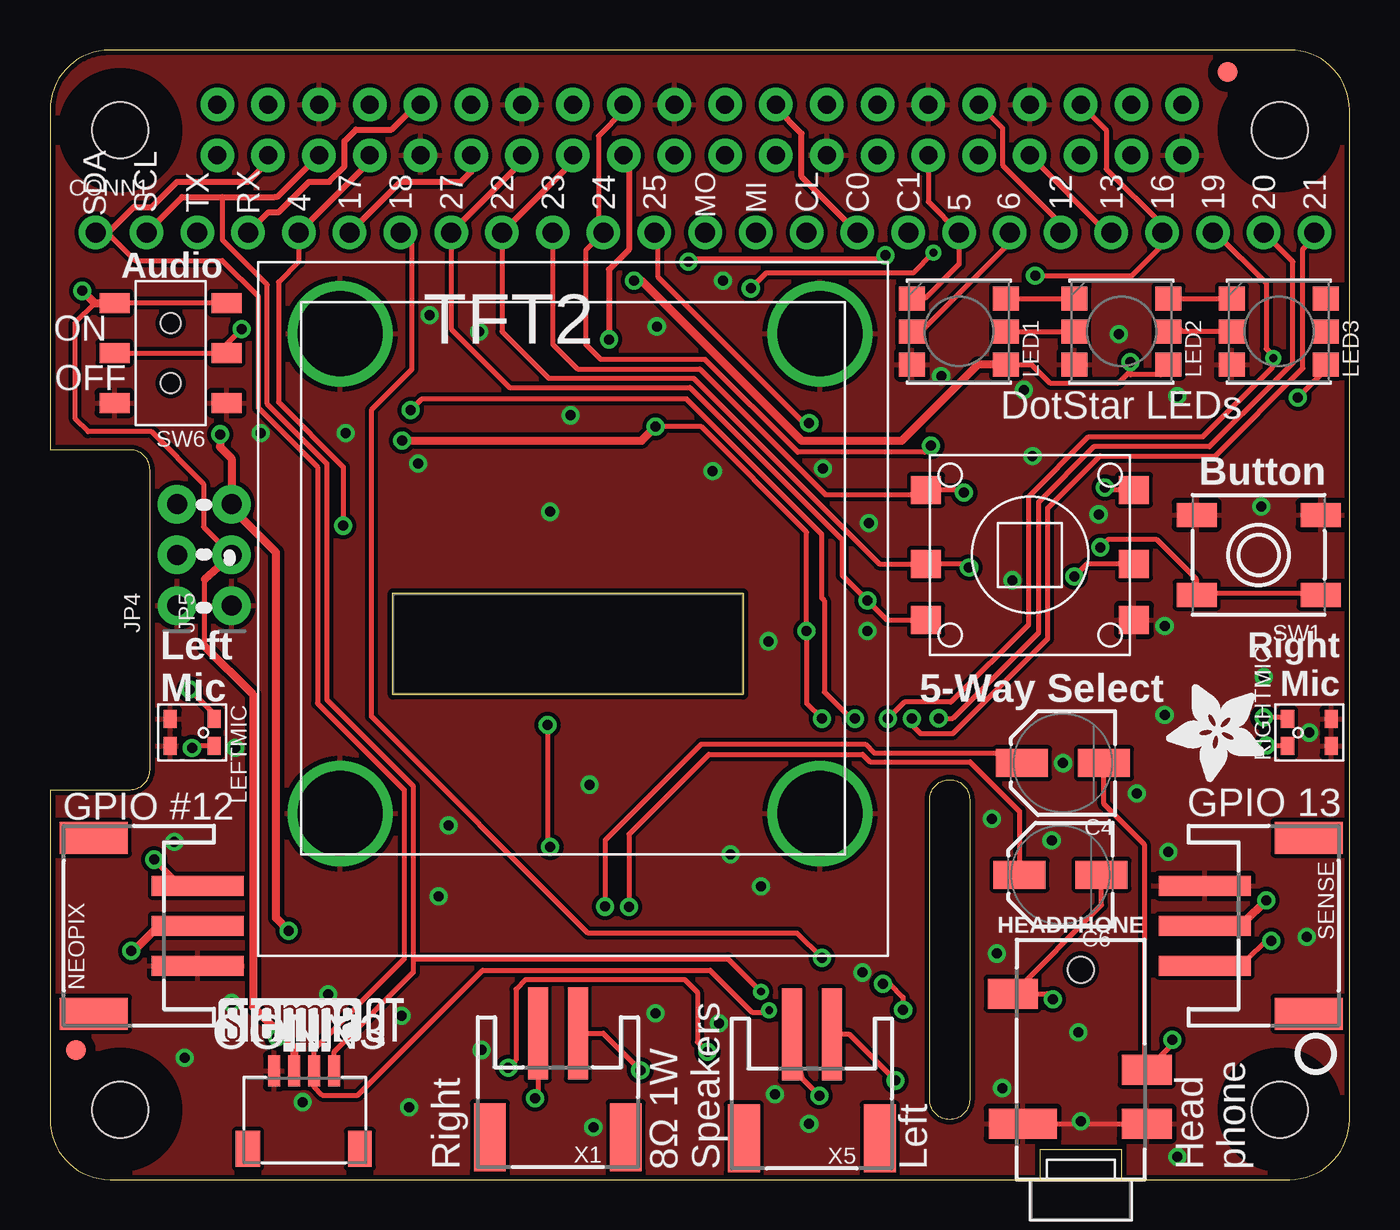
[diagram p3: board, top side]
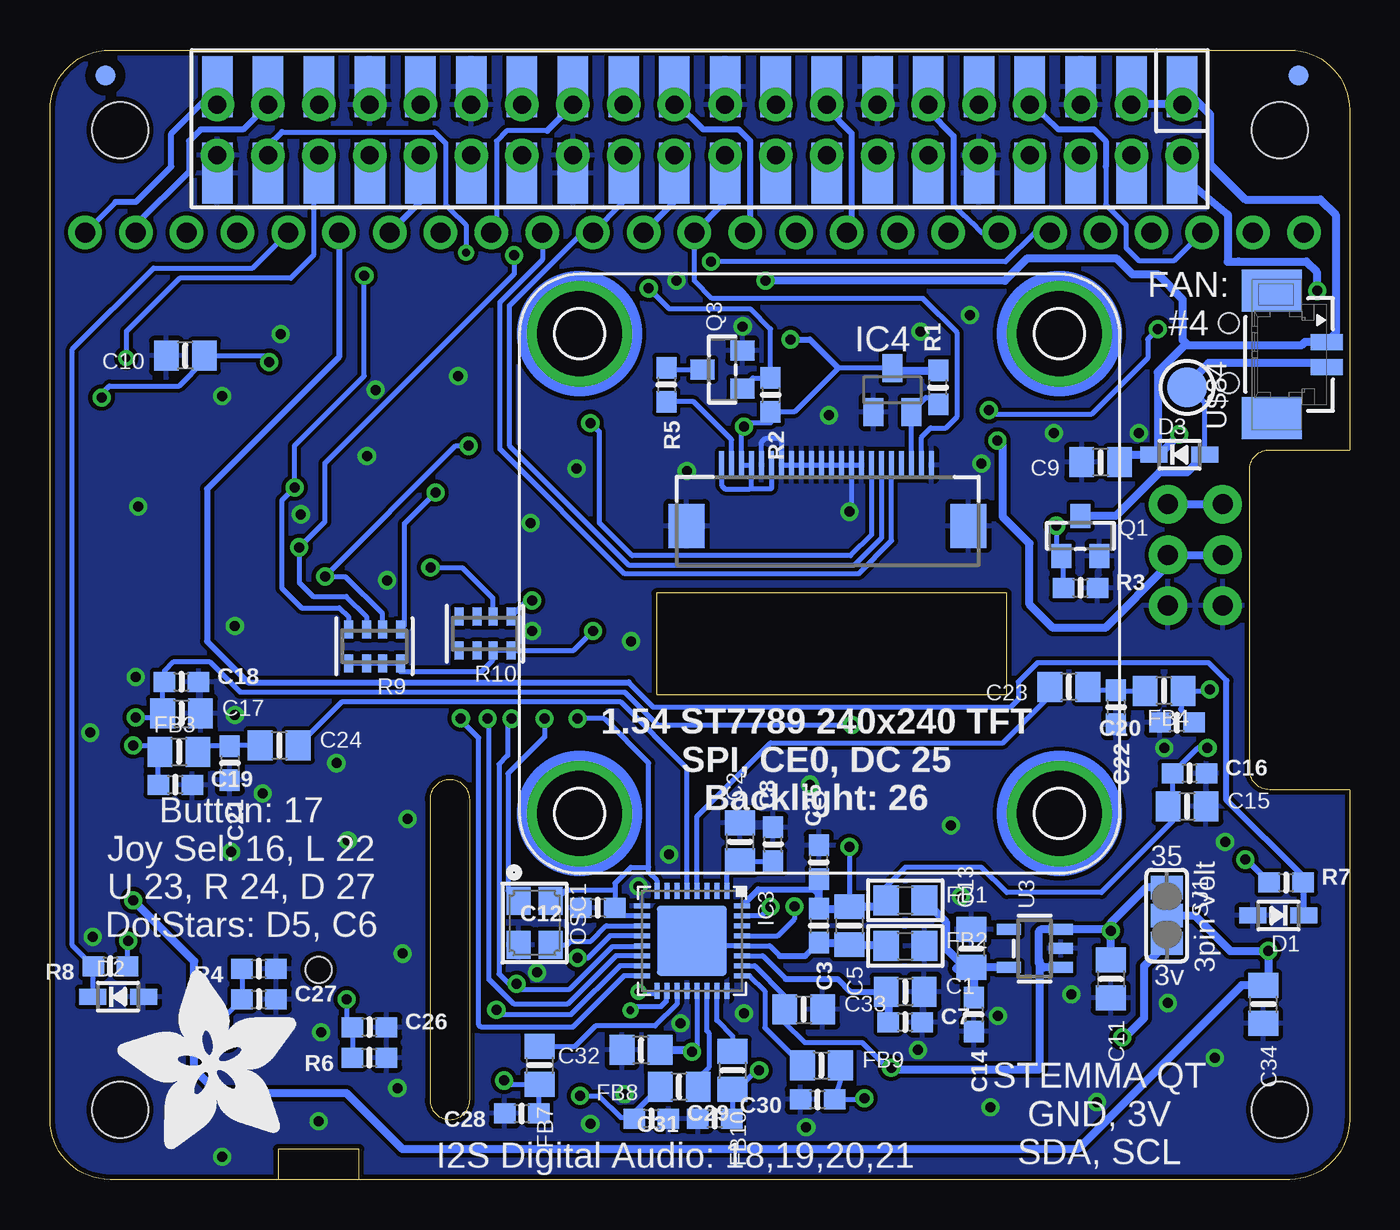
[diagram p4: board, bottom side, seen from below]

Size 65 x 56.5 mm. Coordinates in mm from the lower left corner, seen from the top.
Outline: 49.53,0 49.53,1.52 53.59,1.52 53.59,0
Outline: 17.14,29.34 34.67,29.34 34.67,24.26 17.14,24.26 17.14,29.34
Copper layers (1*16): Top 0.035mm / dielectric 1.5mm / Bottom 0.035mm
Design rules "adafruit": minimum track width 8mil, minimum drill 15.5mil, track to track 8mil, track to pad 8mil, pad to pad 8mil, via to via 8mil, smd to smd 8mil, copper to edge 10mil, drill to drill 8mil, minimum pad ring 10mil, minimum via ring 8mil, stop-mask expansion 2mil, vias tented up to drill 20mil, thermal gap 10mil

### Footprints (pad centres in the part's own frame; a part is rotated, then mirrored left to right if it is on the bottom)
0805-NO = smd 1.24 x 1.5: 1 -0.95,0; 2 0.95,0
0603-NO = smd 1.075 x 1: 1 -0.85,0; 2 0.85,0
PANASONIC_C = smd 2.6 x 1.4: + 2.05,0; - -2.05,0
1X25_ROUND_70MIL = drill 1 pad 1.676: 1 -30.48,0; 2 -27.94,0; 3 -25.4,0; 4 -22.86,0; 5 -20.32,0; 6 -17.78,0; 7 -15.24,0; 8 -12.7,0; 9 -10.16,0; 10 -7.62,0; 11 -5.08,0; 12 -2.54,0; 13 0,0; 14 2.54,0; 15 5.08,0; 16 7.62,0; 17 10.16,0; 18 12.7,0; 19 15.24,0; 20 17.78,0; 21 20.32,0; 22 22.86,0; 23 25.4,0; 24 27.94,0; 25 30.48,0
JST_SH4 = smd 0.6 x 1.55: 1 -1.5,2.514; 2 -0.5,2.514; 3 0.5,2.514; 4 1.5,2.514 | smd 1.2 x 1.8: MT1 -2.8,-1.386; MT2 2.8,-1.386
SOD-323 = smd 1.35 x 0.8: A 1.27,0; C -1.27,0
0805 = smd 1.3 x 1.5: 1 -0.95,0; 2 0.95,0
FIDUCIAL_1MM = smd 1 x 1: 1 0,0
4UCONN_18510 = smd 1.5 x 2.5: 1-GND 2.8,-3.3; 2-TIP 9.3,3.4; 3-OUTER_SLEEVE 5.5,-3.3 | smd 1.5 x 3.4: 4-INNER_SLEEVE 2.8,2.9 | hole 1.3: 10.5,0
QFN32_5MM = smd 0.8 x 0.25: 1 -2.5,1.75; 2 -2.5,1.25; 3 -2.5,0.75; 4 -2.5,0.25; 5 -2.5,-0.25; 6 -2.5,-0.75; 7 -2.5,-1.25; 8 -2.5,-1.75; 17 2.5,-1.75; 18 2.5,-1.25; 19 2.5,-0.75; 20 2.5,-0.25; 21 2.5,0.25; 22 2.5,0.75; 23 2.5,1.25; 24 2.5,1.75 | smd 0.25 x 0.8: 9 -1.75,-2.5; 10 -1.25,-2.5; 11 -0.75,-2.5; 12 -0.25,-2.5; 13 0.25,-2.5; 14 0.75,-2.5; 15 1.25,-2.5; 16 1.75,-2.5; 25 1.75,2.5; 26 1.25,2.5; 27 0.75,2.5; 28 0.25,2.5; 29 -0.25,2.5; 30 -0.75,2.5; 31 -1.25,2.5; 32 -1.75,2.5 | smd 3.5 x 3.5: 33 0,0
SOT23 = smd 1 x 1.4: 1 -0.95,-1.1; 2 0.95,-1.1; 3 0,1.1
1X03_ROUND_76 = drill 1 pad 1.93: 1 -2.54,0; 2 0,0; 3 2.54,0
APA102 = smd 1.3 x 1.2: 1 -2.35,1.65; 2 -2.35,0; 3 -2.35,-1.65; 4 2.35,-1.65; 5 2.35,0; 6 2.35,1.65
SPW2430HR5H-B = smd 0.9 x 0.66: 1 -0.675,1.095; 2 -0.675,-1.095; 3 0.675,-1.095; 4 0.675,1.095
JSTPH3 = smd 1 x 4.6: 1 -2,-2.7; 2 0,-2.7; 3 2,-2.7 | smd 1.6 x 3.4: NC1 -4.4,2.5; NC2 4.4,2.5
OSC_3.2X2.5MM = smd 1.4 x 1.2: 1 -1.1,-0.8; 2 1.1,-0.8; 3 1.1,0.8; 4 -1.1,0.8
SOT23-WIDE = smd 1 x 1.2: 1 -0.95,-1; 2 0.95,-1; 3 0,1
RESPACK_4X0603 = smd 0.45 x 0.9: 1 -1.3,-0.85; 2 -0.4,-0.85; 3 0.4,-0.85; 4 1.3,-0.85; 5 1.3,0.85; 6 0.4,0.85; 7 -0.4,0.85; 8 -1.3,0.85
PI_HAT_SMTTHM_SLOTS = drill 0.9 pad 1.676: 1 8.37,51.23; 2 8.37,53.77; 3 10.91,51.23; 4 10.91,53.77; 5 13.45,51.23; 6 13.45,53.77; 7 15.99,51.23; 8 15.99,53.77; 9 18.53,51.23; 10 18.53,53.77; 11 21.07,51.23; 12 21.07,53.77; 13 23.61,51.23; 14 23.61,53.77; 15 26.15,51.23; 16 26.15,53.77; 17 28.69,51.23; 18 28.69,53.77; 19 31.23,51.23; 20 31.23,53.77; 21 33.77,51.23; 22 33.77,53.77; 23 36.31,51.23; 24 36.31,53.77; 25 38.85,51.23; 26 38.85,53.77; 27 41.39,51.23; 28 41.39,53.77; 29 43.93,51.23; 30 43.93,53.77; 31 46.47,51.23; 32 46.47,53.77; 33 49.01,51.23; 34 49.01,53.77; 35 51.55,51.23; 36 51.55,53.77; 37 54.09,51.23; 38 54.09,53.77; 39 56.63,51.23; 40 56.63,53.77 | smd 1 x 1 bottom: 41 2.54,55.22; 42 62.23,55.22 | smd 1.524 x 3.048 bottom: S1 8.37,50.349; S2 8.37,54.667; S3 10.91,50.349; S4 10.91,54.667; S5 13.45,50.349; S6 13.45,54.667; S7 15.99,50.349; S8 15.99,54.667; S9 18.53,50.349; S10 18.53,54.667; S11 21.07,50.349; S12 21.07,54.667; S13 23.61,50.349; S14 23.61,54.667; S15 26.15,50.349; S16 26.15,54.667; S17 28.69,50.349; S18 28.69,54.667; S19 31.23,50.349; S20 31.23,54.667; S21 33.77,50.349; S22 33.77,54.667; S23 36.31,50.349; S24 36.31,54.667; S25 38.85,50.349; S26 38.85,54.667; S27 41.39,50.349; S28 41.39,54.667; S29 43.93,50.349; S30 43.93,54.667; S31 46.47,50.349; S32 46.47,54.667; S33 49.01,50.349; S34 49.01,54.667; S35 51.55,50.349; S36 51.55,54.667; S37 54.09,50.349; S38 54.09,54.667; S39 56.63,50.349; S40 56.63,54.667 | hole 2.8: 3.5,3.5; 3.5,52.5; 61.5,52.5; 61.5,3.5
SOLDERJUMPER_2WAY_OPEN_NOPASTE = smd 1.168 x 1.6: 1 -1.397,0; 2 0,0; 3 1.397,0
EVQ-Q2_SMALLER = smd 2 x 1.2: A -3.1,-2; A' 3.1,-2; B -3.1,2; B' 3.1,2
SKQUBAE010 = smd 1.5 x 1.4: 1 -5.2,3.25; 2 -5.2,-0.45; 3 -5.2,-3.25; 4 5.2,-3.25; 5 5.2,-0.45; 6 5.2,3.25
EG1390 = smd 1 x 1.5: O1 -2.5,2.8; O2 -2.5,-2.8; P1 0,2.8; P2 0,-2.8; S1 2.5,2.8; S2 2.5,-2.8 | hole 1: 1.5,0; -1.5,0
TFT_1.54IN_240X240_22PIN = smd 0.25 x 1.4 bottom: 1 5.25,2.722; 2 4.75,2.722; 3 4.25,2.722; 4 3.75,2.722; 5 3.25,2.722; 6 2.75,2.722; 7 2.25,2.722; 8 1.75,2.722; 9 1.25,2.722; 10 0.75,2.722; 11 0.25,2.722; 12 -0.25,2.722; 13 -0.75,2.722; 14 -1.25,2.722; 15 -1.75,2.722; 16 -2.25,2.722; 17 -2.75,2.722; 18 -3.25,2.722; 19 -3.75,2.722; 20 -4.25,2.722; 21 -4.75,2.722; 22 -5.25,2.722 | smd 1.8 x 2.2 bottom: SUPPORT1 7,-0.328; SUPPORT2 -7.1,-0.328
SMT_NUT_3MM = drill 4.25 pad 4.572: P$1 0,0
TESTPOINT_ROUND_2MM = smd 2 x 2: P$1 0,0
SOT23-5 = smd 0.55 x 1.2: 1 -0.95,-1.3; 2 0,-1.3; 3 0.95,-1.3; 4 0.95,1.3; 5 -0.95,1.3
53398-0271 = smd 0.8 x 1.6: 1 0.625,-1.27; 2 -0.625,-1.27 | smd 2.1 x 3: M1 3.185,1.48; M2 -3.185,1.48
JSTPH2 = smd 1 x 4.6: 1 -1,-3.7; 2 1,-3.7 | smd 1.6 x 3.4: NC1 -3.4,1.5; NC2 3.4,1.5

### Placement (x,y rotation side)
C1  22.23,9.4 0 bottom
C2  30.48,16.89 90 bottom
C3  26.54,12.7 270 bottom
C4  50.67,20.83 180 top
C5  25.02,12.7 270 bottom
C6  50.55,15.24 180 top
C7  22.23,7.87 0 bottom
C8  28.83,16.76 90 bottom
C9  12.45,35.88 180 bottom
C10  58.23,41.21 180 bottom
C11  11.94,10.03 270 bottom
C12  37.59,13.59 180 bottom
C13  18.92,11.56 90 bottom
C14  18.8,8.26 270 bottom
C15  8.13,18.67 0 bottom
C16  8,20.32 0 bottom
C17  58.42,23.3 0 bottom
C18  58.42,24.89 0 bottom
C19  58.74,19.75 0 bottom
C20  8.64,22.86 180 bottom
C21  56.01,20.83 270 bottom
C22  11.68,23.62 270 bottom
C23  14.03,24.64 180 bottom
C24  53.53,21.72 0 bottom
C25  26.54,15.88 90 bottom
C26  49.02,7.62 0 bottom
C27  54.55,9.02 0 bottom
C28  41.4,3.3 180 bottom
C29  34.92,3.05 0 bottom
C30  26.61,4 180 bottom
C31  31.75,3.05 180 bottom
C32  35.43,6.48 180 bottom
C33  27.3,8.51 0 bottom
C34  4.32,8.76 270 bottom
CONN1  32.77,47.37 0 top
CONN3  12.7,2.92 0 top
D1  3.56,13.21 180 bottom
D2  61.59,9.14 0 bottom
D3  8.51,36.26 0 bottom
FB1  22.23,13.97 0 bottom
FB2  22.23,11.68 0 bottom
FB3  58.55,21.4 0 bottom
FB4  9.27,24.45 180 bottom
FB7  40.51,5.71 270 bottom
FB8  33.53,4.64 180 bottom
FB9  26.42,5.71 0 bottom
FB10  30.86,5.46 270 bottom
FID1  1.3,6.47 0 top
FID2  58.91,55.39 0 top
HEADPHONE  51.56,0 90 top
IC3  32.89,11.94 270 bottom
IC4  22.86,39.5 0 bottom
JP4  6.35,31.24 90 top
JP5  9.08,31.24 90 top
LED1  45.47,42.42 0 top
LED2  53.59,42.42 0 top
LED3  61.47,42.42 0 top
LEFTMIC  7.11,22.35 270 top
NEOPIX  4.7,12.7 90 top
OSC1  40.77,12.83 270 bottom
Q1  13.46,32.19 0 bottom
Q3  31.37,40.51 90 bottom
R1  20.57,39.62 90 bottom
R2  28.96,39.24 270 bottom
R3  13.46,29.59 0 bottom
R4  54.55,10.54 180 bottom
R5  34.16,39.75 270 bottom
R6  49.02,6.1 180 bottom
R7  3.17,14.86 0 bottom
R8  61.98,10.67 180 bottom
R9  48.77,26.67 180 bottom
R10  43.24,27.3 180 bottom
RIGHTMIC  62.99,22.35 90 top
RPI1  0,0 0 top
SENSE  60.45,12.7 270 top
SJ1  9.14,13.21 270 bottom
SW1  60.45,31.24 180 top
SW5  49.02,31.24 0 top
SW6  6.03,41.34 90 top
TFT2  26.16,33.02 0 top
TP1  38.51,42.3 0 bottom
TP2  14.51,42.3 0 bottom
TP3  14.51,18.3 0 bottom
TP4  38.51,18.3 0 bottom
TP6  8.13,39.62 0 bottom
U3  15.75,11.56 90 bottom
U$11  [PCBFEAT-REV-040]  63.3,6.28 0 top
U$72  [STEMMAQT]  8.45,6.41 0 top
U$75  [ADAFRUIT_5MM]  60.71,24.77 180 top
U$79  [BRAINPAD_1IN]  64.64,27.37 0 bottom
U$82  [FAN_30X30MM]  26.51,30.3 0 bottom
U$84  2.41,41.27 90 bottom
U$87  [ADAFRUIT_9MM]  52.7,1.52 90 bottom
X1  25.4,3.62 180 top
X5  38.1,3.56 180 top

### Tracks (layer width: path | path; a pad name or v marks a point on that pad's centre or on a via)
3.3V  (via drill 0.5)
  Top 0.254: v38.61,23.05 37.85,23.81 v37.85,27.43 37.85,32.38 32.58,37.66 v30.29,37.66 | SW6.S2 SW6.S1 | 7.75,26.67 7.75,30.04 | JP5.2 7.68,32.64 7.68,34.8 5.08,37.4 1.91,37.4 1.27,38.04 1.27,42.88 2.23,43.84 | 11.37,7.43 v11.37,7.11
  Top 0.305: RPI1.17 28.96,50.96 28.96,46.51 27.96,45.52 v27.96,42.02
  Top 0.406: v17.61,36.96 29.59,36.96 v30.29,37.66 | v11.37,7.11 11.68,7.11 12.2,6.6 CONN3.2 | 7.75,26.67 10.16,24.26 10.16,8.64 11.37,7.43 | 7.75,30.04 JP5.2 | SW6.S1 2.23,43.84 v1.62,44.45
  Bottom 0.254: TFT2.6 28.91,34.59 28.96,34.54 29.84,34.54 29.91,34.61 | 29.91,34.61 TFT2.4 TFT2.3 30.41,37.52 30.42,37.53 v30.29,37.66 30.1,37.85 28.96,37.85 R2.2 27.77,38.39 25.57,40.6 IC4.3 | TFT2.1 31.41,34.71 31.24,34.54 29.98,34.54 29.91,34.61 | IC3.8 34.64,14.96 35.05,15.37 35.05,15.62 | R9.5 R9.6 R9.7 R9.8 47.47,25.4 43.43,25.4 42.84,25.99 R10.7 R10.8 38.82,26.45 v37.85,27.43 | 35.05,15.62 35.05,20.83 37.27,23.05 v38.61,23.05 | OSC1.4 39.73,13.93 39.18,14.48 36.74,14.48 | IC3.10 36.34,13.19 C12.1 36.74,14.48 | 36.74,14.48 36.74,14.82 35.94,15.62 35.05,15.62
  Bottom 0.305: RPI1.S1 RPI1.1 | RPI1.1 | RPI1.S17 RPI1.17 | RPI1.17 | v27.96,42.02 27,42.02 25.57,40.6
  Bottom 0.406: IC4.3 22.74,40.47 R1.2 | RPI1.1 8.37,50.15 6.1,48.27 6.1,45.91 5.57,45.91 5.56,45.92 2.16,45.92 1.65,45.4 1.65,44.48 v1.62,44.45 | v17.61,36.96 17.36,36.7 17.36,33.17 16,31.81 16,28.77 14.83,27.59 12.22,27.59 9.08,30.73 JP5.2 JP4.2 | SJ1.3 10.29,10.67 10.29,8.06 11.24,7.11 v11.37,7.11
5.0V  (via drill 0.5)
  Top 0.254: LED1.4 49.09,40.77 50.04,39.81 53.4,39.81 54.04,40.45 v54.04,40.89 54.04,40.26 55.56,40.26 55.94,40.64 LED2.4 | v62.42,39.12 63.82,40.51 LED3.4 | v22.92,5.59 23.3,5.97 23.3,9.53 23.79,10.01 31.74,10.01 32.38,9.36 32.38,6.89 v32.89,6.38
  Top 0.406: v11.94,12.45 11.3,13.08 11.3,31.37 9.08,33.59 JP5.3 9.08,36.07 8.51,36.64 v8.51,37.27 | v29.21,44.96 29.59,44.96 37.59,36.96 42.61,36.96 46.42,40.77 LED1.4
  Bottom 0.254: v62.42,39.12 62.42,39.31 62.04,39.69 58.55,39.69 57.28,40.96 C10.1 54.3,41.21 54.04,40.95 v54.04,40.89 | IC3.21 32.64,6.63 | IC3.26 29.75,10.69 28.25,9.19 C33.1 28.25,7.87 27.24,6.86 24.38,6.86 23.11,5.59 v22.92,5.59
  Bottom 0.305: v32.89,6.38 32.64,6.63 | RPI1.S4 10.91,53.8 | 10.91,53.8
  Bottom 0.406: U3.1 15.31,10.61 15.56,10.86 15.56,10.99 | 15.56,10.99 15.49,10.92 15.49,5.52 22.86,5.52 v22.92,5.59 | 15.56,10.99 15.56,12.38 15.43,12.51 U3.3 12,12.51 v11.94,12.45 | C11.1 v11.94,12.45 | v11.94,12.45 11.94,12.83 10.16,14.61 SJ1.1 | RPI1.2 8.37,53.8 10.91,53.8 RPI1.4 | RPI1.2 RPI1.S2 6.99,53.28 6.99,50.8 5.21,49.02 1.46,49.02 0.7,48.26 0.7,42.34 U$84.1 2.23,41.9 2.41,41.72 8.06,41.72 | RPI1.2 | v29.21,44.96 17.23,44.96 16.1,46.09 11.67,46.09 10.86,45.28 9.59,45.28 8.35,44.04 8.35,42.01 8.06,41.72 | C32.1 32.99,6.48 v32.89,6.38 | JP5.3 JP4.3 | D3.C 9.59,36.45 9.59,40.39 8.26,41.72 8.06,41.72 | C9.1 11.12,36.26 D3.C | D3.C 9.52,36.26 v8.51,37.27
AGND
  Bottom 0.254: 28.49,11.18 29,11.69 IC3.28 32.64,11.69 IC3.33
  Bottom 0.305: 28.49,11.18 27.21,11.18 C3.2
  Bottom 0.406: C3.2 25.12,11.85 C5.2 23.24,11.75 FB2.1
AVDD  (via drill 0.5)
  Top 0.254: RIGHTMIC.4 61.81,23.11 v60.71,23.11 | v24.89,22.73 24.89,16.76 v25.02,16.64 | LEFTMIC.4 7.19,21.68 v7.1,21.59
  Bottom 0.254: C16.1 8.85,18.9 C15.1 | v60.71,23.11 59.56,23.11 C17.1 59.37,24.79 C18.1 59.27,25.44 58.8,25.91 57.02,25.91 55.5,24.38 36.26,24.38 34.61,22.73 v24.89,22.73 | C16.1 8.85,17.91 12.41,14.35 17.14,14.35 18.41,15.62 22.23,15.62 23.18,14.67 FB1.1 | v25.02,16.64 C5.1 | C16.1 7.58,21.59 v7.1,21.59
  Bottom 0.305: IC3.32 29.57,14.51 26.81,14.51 26.54,14.25 C3.1
  Bottom 0.406: C25.1 C3.1 25.12,13.55 C5.1 23.5,13.65 FB1.1
BUTTON  (via drill 0.5)
  Top 0.254: SW1.B 63.46,29.34 57.45,29.34 SW1.B' 57.35,30 55.35,32 52.91,32 v52.53,31.62 | v41.78,46.23 41.59,46.04 32.07,46.04 v31.94,45.91
  Top 0.305: CONN1.6 17.53,49.91 20.57,49.91 21.07,50.41 RPI1.11
  Bottom 0.254: CONN1.6 15.75,47.37 17.21,45.91 v31.94,45.91 | v41.78,46.23 41.78,45.29 51.26,35.81 51.26,32.89 v52.53,31.62 52.53,29.86 51.84,29.17 50.18,29.17 49.17,28.16 R9.3
  Bottom 0.305: RPI1.S11 RPI1.11 | RPI1.11
EECLK
  Bottom 0.305: RPI1.S28 | RPI1.S28 RPI1.28
EEDATA
  Bottom 0.305: RPI1.S27 RPI1.27 | RPI1.27
FAN  (via drill 0.5)
  Top 0.254: CONN1.5 12.45,45.91 11.43,44.9 11.43,38.88 14.67,35.65 v14.67,32.7
  Top 0.305: CONN1.5 15.99,50.91 RPI1.7
  Bottom 0.254: R3.1 14.31,31.09 Q1.1 14.67,31.45 v14.67,32.7
  Bottom 0.305: RPI1.S7 RPI1.7 | RPI1.7
GND  (via drill 0.5)
  Top 0.254: HEADPHONE.4-INNER_SLEEVE HEADPHONE.1-GND
  Bottom 0.254: TFT2.5 29.41,36.88 29.21,37.08 28.57,37.08 28.41,36.92 TFT2.7 TFT2.8 TFT2.9 TFT2.10 TFT2.11 TFT2.12 TFT2.13 TFT2.14 | TFT2.14 TFT2.15 | TFT2.14 24.91,33.4 v25.02,33.4
  Bottom 0.305: RPI1.S30 | RPI1.S30 RPI1.30
  other vias: 21.59,6.48 17.97,3.62 6.73,6.1 9.08,8.83 17.59,8.19 19.43,14.16 13.91,9.27 19.94,17.72 26.99,19.75 34.04,16.26 47.62,4.57 51.56,2.92 51.44,7.37 47.37,11.3 55.94,16.38 62.87,12.13 50.1,16.95 50.67,20.83 62.99,22.35 55.75,23.24 54.36,19.3 55.75,27.69 60.58,33.66 60.71,25.15 56.39,39.18 49.15,36.2 53.47,42.29 44.58,40.2 48.7,39.5 38.67,35.56 30.35,42.67 33.15,35.43 18.41,35.81 18.99,43.24 14.8,37.34 10.54,37.34 40.64,10.35 47.12,18.03 6.22,16.89 9.27,21.59 30.29,8.32 35.94,26.92 40.89,27.43 21.46,42.42 26.04,38.23 33.66,44.96 37.97,2.79 36.26,4.25 35.56,14.67 48.13,29.97 40.96,32.83 27.18,2.6 12.64,3.87 56.39,1.14 33.46,7.81 52.45,33.27
  pour Bottom: 0,56.52 65.02,56.52 65.02,0 0,0
  pour Top: 0,56.52 65.02,56.52 65.02,0 0,0
I2S_BCLK  (via drill 0.5)
  Top 0.254: v38.61,11.08 37.37,12.32 26.92,12.32 16.07,23.18 16.07,38.48 18.1,40.51 18.1,46.8 CONN1.7
  Bottom 0.254: IC3.12 36.99,12.19 38.1,11.08 v38.61,11.08 | CONN1.7 18.41,47.37 18.9,47.85 19.58,48.54 19.81,48.77
  Bottom 0.305: 19.81,48.77 19.81,52.2 21.07,53.45 RPI1.12 | RPI1.S12 RPI1.12 | RPI1.12
I2S_DIN  (via drill 0.5)
  Top 0.254: v44.45,23.07 45.16,23.07 49.45,27.37 49.45,33.9 52.21,36.65 58,36.65 61.29,39.94 61.29,39.95 62.17,40.83 62.17,45.91 CONN1.24
  Bottom 0.254: IC3.16 36.29,10.19 38.86,7.62 43.43,7.62 43.56,7.75 43.56,22.1 44.45,22.99 v44.45,23.07 | CONN1.24 60.71,47.75
  Bottom 0.305: RPI1.38 55.35,52.51 57.47,52.51 58.04,51.94 58.04,50.42 60.71,47.75 | RPI1.S38 RPI1.38 | RPI1.38
I2S_DOUT  (via drill 0.5)
  Top 0.254: CONN1.25 63.37,47.24 62.67,46.55 62.67,40.58 58.29,36.2 52.51,36.2 49.91,33.59 49.91,27.05 45.15,22.29 43.56,22.29 43.12,22.73 v43.12,23.05
  Bottom 0.254: 56.68,53.85 56.63,53.9 RPI1.40 | IC3.14 36.69,11.19 39.12,8.76 41.78,8.76 43.05,10.03 43.05,22.99 v43.12,23.05 | 61.72,48.9 CONN1.25
  Bottom 0.305: 61.72,48.9 60.71,48.9 58.93,50.67 58.93,52.32 57.4,53.85 56.68,53.85 | RPI1.S40 RPI1.40 | RPI1.40
I2S_LRCLK  (via drill 0.39, 0.5)
  Top 0.254: v41.91,23.05 42.74,23.88 45.06,23.88 48.95,27.77 48.95,34.17 51.94,37.16 57.67,37.16 61.16,40.65 v61.18,41.08 61.18,41.21 60.83,41.56 60.83,44.83 58.29,47.37 CONN1.23 | v42.67,8.49 42.67,9.12 42.02,9.78 v41.66,9.78
  Bottom 0.254: IC3.13 35.44,11.64 36.88,11.64 39,9.53 41.4,9.53 v41.66,9.78 41.85,9.59 42.55,10.29 42.55,20.77 42.1,21.21 42.1,22.86 v41.91,23.05 | IC3.15 36.49,10.69 38.92,8.26 42.44,8.26 v42.67,8.49 | RPI1.S35 51.82,50.08 51.82,46.23 52.96,45.09 58.52,45.09 61.18,42.42 v61.18,41.08
  Bottom 0.305: RPI1.35 51.55,51.18 | RPI1.S35 51.55,51.18 | 51.55,51.18
JOY_D  (via drill 0.5)
  Top 0.254: CONN1.8 20.07,42.55 22.99,39.62 32,39.62 39.62,32 39.62,30.23 v40.89,28.96 41.86,27.99 SW5.3
  Top 0.305: CONN1.8 23.61,50.91 RPI1.13
  Bottom 0.254: R10.1 41.02,29.08 v40.89,28.96
  Bottom 0.305: RPI1.S13 RPI1.13 | RPI1.13
JOY_IN  (via drill 0.5)
  Top 0.254: SW5.6 52.88,34.49 v52.77,34.61 | v49.28,45.21 54.1,45.21 55.63,46.74 CONN1.22 55.63,47.75 52.83,50.55 52.83,52.49 RPI1.36
  Bottom 0.254: v49.28,45.21 49.28,40.2 52.77,36.7 v52.77,34.61 53.4,33.97 53.4,29.59 52.42,28.6 50.51,28.6 50.07,28.16 R9.4
  Bottom 0.305: RPI1.S36 RPI1.36 | RPI1.36
JOY_L  (via drill 0.5)
  Top 0.254: CONN1.9 22.61,42.42 24.94,40.08 32.19,40.08 41.48,30.79 SW5.2 45.79,30.79 v45.97,30.61
  Top 0.305: CONN1.9 26.15,50.91 RPI1.15
  Bottom 0.254: R10.2 42.84,29.06 44.39,30.61 v45.97,30.61
  Bottom 0.305: RPI1.S15 RPI1.15 | RPI1.15
JOY_R  (via drill 0.5)
  Top 0.254: RPI1.18 28.69,53.45 27.43,52.2 27.43,47.62 CONN1.11 26.8,46.48 26.8,41.78 27.56,41.02 32.77,41.02 37.4,36.39 43.75,36.39 v44.07,36.7 | SW5.5 51.87,30.79 v51.24,30.16
  Bottom 0.254: v44.07,36.7 44.7,36.7 v51.24,30.16 50.23,30.16 48.37,28.3 R9.2
  Bottom 0.305: RPI1.S18 RPI1.18 | RPI1.18
JOY_U  (via drill 0.5)
  Top 0.254: CONN1.10 25.15,41.78 26.39,40.54 32.51,40.54 38.81,34.24 43.57,34.24 SW5.1 45.58,34.49 v45.72,34.35
  Bottom 0.254: R9.1 47.28,27.71 47.28,32.8 v45.72,34.35
  Bottom 0.305: CONN1.10 24.89,47.62 24.89,52.32 26.15,53.58 RPI1.16 | RPI1.S16 RPI1.16 | RPI1.16
LEDC
  Top 0.254: CONN1.19 48.01,46.86 43.56,42.42 LED1.2
  Bottom 0.305: CONN1.19 46.47,48.91 RPI1.31 RPI1.S31 | RPI1.S31
LEDD
  Top 0.254: LED1.1 43.75,44.07 45.47,45.78 CONN1.18 43.93,48.91 RPI1.29
  Bottom 0.305: RPI1.S29 | RPI1.S29 RPI1.29
LEDK
  Bottom 0.254: TFT2.2 30.91,37.01 32.8,38.9 R5.2
LINPUT1
  Bottom 0.254: IC3.4 32.64,18.16 28.96,21.84 17.33,21.84 14.98,24.19 C23.2
LITE  (via drill 0.39, 0.5)
  Top 0.254: v35.05,44.58 35.81,45.34 43.18,45.34 v44.2,46.35
  Bottom 0.254: Q3.1 29.84,40.09 R2.1 28.96,42.55 29.97,43.56 34.04,43.56 v35.05,44.58 | 53.39,52.4 45.77,52.4 45.21,51.84 45.21,48.77 44.98,48.54 44.2,47.75 v44.2,46.35
  Bottom 0.305: RPI1.37 RPI1.S37 54.09,51.7 53.39,52.4 | RPI1.37
LSTEMMA  (via drill 0.5)
  Top 0.305: NEOPIX.3 6.38,14.83 v5.21,16
  Bottom 0.305: v5.21,16 5.17,16 R7.1
MCLK
  Bottom 0.254: OSC1.3 39.14,11.73 38.95,11.92 37.95,11.92 37.18,12.69 IC3.11
MCLK_EN  (via drill 0.5)
  Top 0.254: v40.26,23.05 40.07,23.05 38.73,24.38 38.73,28.96 38.61,29.08 38.61,32.27 31.84,39.04 18.59,39.04 v18.03,38.48 | SW6.P1 SW6.P2 8.83,41.79 v9.59,42.55
  Bottom 0.254: v18.03,38.48 17.84,38.29 12.89,38.29 10.1,41.08 10.1,42.04 v9.59,42.55 | v40.26,23.05 40.26,22.13 42.09,20.3 42.09,14.45 OSC1.1
MICBIAS
  Bottom 0.254: IC3.1 31.14,15.28 C2.1 30.45,15.91 C8.1
N$1
  Bottom 0.254: IC3.19 33.64,8.78 34.73,7.68 37.72,7.68 38.73,6.67 FB7.1
N$2
  Bottom 0.254: FB8.1 32.58,5.08 32.02,5.64 32.02,7.3 32.14,7.43 IC3.22
N$3  (via drill 0.5)
  Top 0.254: C6.+ 48.5,18.41 46.02,20.89 41.02,20.89 40.64,21.27 32.96,21.27 28.96,17.27 v28.96,13.64
  Bottom 0.254: v28.96,13.64 29.41,13.19 IC3.31
N$4
  Bottom 0.254: R5.1 34.08,40.51 Q3.3
N$5  (via drill 0.5)
  Top 0.254: v27.76,13.65 27.76,16.97 32.58,21.78 40.78,21.78 41.21,21.35 48.1,21.35 C4.+
  Bottom 0.254: IC3.29 28.59,12.19 27.76,13.02 v27.76,13.65
N$7
  Top 0.254: LED1.6 LED2.1
N$9  (via drill 0.5)
  Top 0.254: v56.13,6.99 56.13,6.77 HEADPHONE.3-OUTER_SLEEVE 54.73,5.63 54.73,16.77 52.72,18.78 C4.-
  Bottom 0.254: R4.2 C27.1 56.13,8.28 v56.13,6.99
N$10  (via drill 0.5)
  Top 0.254: v50.16,9.02 49.88,9.3 HEADPHONE.2-TIP 52.6,13.73 C6.-
  Bottom 0.254: R6.2 49.53,6.07 49.87,6.39 C26.1 50.16,7.91 v50.16,9.02
N$11
  Top 0.254: LED1.5 LED2.2
N$12  (via drill 0.5)
  Top 0.254: RIGHTMIC.1 60.87,21.68 v60.83,21.72
  Bottom 0.254: C19.1 59.59,21.32 FB3.1 59.34,21.72 v60.83,21.72
N$13  (via drill 0.5)
  Top 0.254: LEFTMIC.1 8.21,23.29 v6.99,24.51
  Bottom 0.254: v6.99,24.51 7.05,24.45 FB4.1 8.44,23.52 C20.1
N$14
  Top 0.254: LED2.6 LED3.1
N$15
  Top 0.254: LED3.2 56.64,42.42 56.52,42.55 56.07,42.55 LED2.5
N$16
  Bottom 0.254: C24.1 55.97,21.72 C21.1 57.91,21.68 FB3.2
N$17
  Bottom 0.254: FB4.2 11.66,24.45 C22.1 12.92,24.47 C23.1
N$18
  Bottom 0.254: 9.14,14.35 9.14,13.46
N$19
  Bottom 0.254: 8.13,39.75 7.24,38.86 D3.A
  Bottom 0.406: U$84.2 1.33,40.84 7.04,40.84 8.13,39.75 TP6.P$1 | D3.A 8.13,35.37 9.53,35.37 11.7,33.19 Q1.3
N$21
  Bottom 0.254: IC3.25 30.01,10.19 29.25,9.43 29.25,7.6 FB9.1
N$22
  Bottom 0.254: FB10.1 30.86,7.17 31.64,7.96 IC3.23
OUT
  Bottom 0.406: U3.5 C13.1 | FB1.2 20.19,12.88 20.19,11.56 19.24,10.61 C13.1 | C14.1 18.8,10.22 19.12,10.54 19.68,10.54 19.62,10.61 C13.1
PWM0
  Top 0.254: RPI1.32 47.64,52.6 47.64,50.75 50.55,47.84 CONN1.20
  Bottom 0.254: 36.06,24.87 34.81,23.62 16.95,23.62 16.57,24 16.57,24.89 15.62,25.84 7.05,25.84 6.16,24.96
  Bottom 0.305: D1.C 2.33,13.25 R7.2 2.33,15.15 6.16,18.99 6.16,24.96 | CONN1.20 50.55,41.15 57.15,34.54 57.15,26.92 55.09,24.87 36.06,24.87 | RPI1.S32 | RPI1.S32 RPI1.32
PWM1
  Top 0.254: RPI1.33 52.87,47.37 CONN1.21
  Bottom 0.254: D2.C 62.83,9.18 R8.2 63.88,11.72 63.88,41.53 59.82,45.59 54.86,45.59 CONN1.21
  Bottom 0.305: RPI1.S33 | RPI1.S33 RPI1.33
RINPUT1
  Bottom 0.254: IC3.5 33.14,20.57 36.45,23.88 50.42,23.88 C24.2
RSTEMMA  (via drill 0.5)
  Top 0.254: SENSE.3 59.72,10.83 60.96,12.06 v61.09,11.94
  Bottom 0.254: v61.09,11.94 61.09,11.99 61.13,12.03 R8.1
RXD
  Top 0.305: CONN1.4 10.92,48.39 11.43,48.39 12.95,49.91 13.97,49.91 14.73,50.67 14.73,51.94 15.3,52.51 17.08,52.51 18.46,53.9 18.46,53.84 RPI1.10
  Bottom 0.305: RPI1.S10 RPI1.10 | RPI1.10
SCL  (via drill 0.39)
  Top 0.254: v35.56,9.4 33.91,11.05 18.17,11.05 | 8.64,49.15 8.64,46.99 10.87,44.75 10.87,38.8 13.85,35.82 13.85,24.01 18.17,19.68 18.17,11.05 | CONN3.4 14.2,6.38 18.17,10.35 18.17,11.05
  Top 0.305: CONN1.2 6.6,49.15 8.64,49.15 11.24,49.15 11.36,49.14 RPI1.5
  Bottom 0.254: IC3.17 34.77,9.31 35.47,9.31 v35.56,9.4
  Bottom 0.305: RPI1.S5 RPI1.5 | RPI1.5
SDA  (via drill 0.39)
  Top 0.254: v35.97,8.47 35.91,8.47 35.78,8.34 35.15,8.34 33.02,10.46 21.64,10.46 15.4,4.22 13.62,4.22 13.2,4.64 CONN3.3 13.2,6.51 17.72,11.03 17.72,19.49 17.46,19.75 17.45,19.75 13.39,23.81 13.39,35.64 10.41,38.61 10.41,44.18 8.62,45.97 4.25,45.97 2.86,47.37 CONN1.1
  Top 0.305: CONN1.1 2.92,47.37 4.19,48.64 5.08,48.64 6.35,49.91 9.91,49.91 10.91,50.91 RPI1.3
  Bottom 0.254: IC3.18 34.19,9.39 34.19,8.9 34.43,8.66 35.78,8.66 v35.97,8.47
  Bottom 0.305: RPI1.S3 RPI1.3 | RPI1.3
SPI_CE1
  Bottom 0.254: 40.13,52.45 42.16,52.45 42.67,51.94 42.67,47.62 CONN1.17
  Bottom 0.305: RPI1.26 RPI1.S26 38.85,53.73 40.13,52.45 | RPI1.26
SPI_MISO
  Bottom 0.305: CONN1.14 33.77,48.91 RPI1.S21 | RPI1.S21 | RPI1.S21 RPI1.21
SPK_LN  (via drill 0.5)
  Top 0.254: v29.53,5.46 27.67,7.32 X1.1
  Bottom 0.254: v29.53,5.46 29.65,5.46 30.73,4.38 FB10.2 30.86,3.09 C31.1
SPK_LP  (via drill 0.5)
  Top 0.254: X1.2 24.4,4.06 v24.26,4.06
  Bottom 0.254: FB9.2 25.47,4.99 C30.1 24.32,4 v24.26,4.06
SPK_RN  (via drill 0.5)
  Top 0.254: v42.29,4.95 39.99,7.26 X5.1
  Bottom 0.254: C28.1 FB7.2 42.1,4.76 v42.29,4.95
SPK_RP  (via drill 0.5)
  Top 0.254: X5.2 37.61,5.06 v38.48,4.19
  Bottom 0.254: C29.1 35.77,3.34 FB8.2 36,3.11 36.45,3.11 37.53,4.19 v38.48,4.19
TFT_CS
  Top 0.254: CONN1.16 40.07,47.69
  Top 0.305: 40.07,47.69 37.59,50.16 37.59,52.32 36.31,53.61 RPI1.24
  Bottom 0.254: TFT2.18 22.91,31.95 24.57,30.29 36.26,30.29 42.49,36.52 42.49,43.88 40.37,46.01 40.37,47.35 CONN1.16
  Bottom 0.305: RPI1.S24 | RPI1.S24 RPI1.24
TFT_DC  (via drill 0.5)
  Top 0.254: v37.97,37.85 37.72,37.85 30.42,45.15 30.42,47.18 CONN1.12
  Bottom 0.254: TFT2.16 23.91,32.24 24.95,31.2 35.88,31.2 37.52,32.84 37.52,37.39 v37.97,37.85
  Bottom 0.305: CONN1.12 29.97,47.62 29.97,51.94 30.54,52.51 32.32,52.51 33.7,53.9 | 33.7,53.9 33.7,53.84 RPI1.22 | RPI1.S22 33.7,54.6 33.7,53.9
TFT_MOSI
  Bottom 0.254: TFT2.21 21.41,37.13 20.95,37.59 20.19,37.59 19.62,38.16 19.62,42.35 21.34,44.07 31.88,44.07 32.77,44.96 CONN1.13
  Bottom 0.305: CONN1.13 31.23,48.91 RPI1.19 | RPI1.S19 RPI1.19 | RPI1.19
TFT_RESET
  Bottom 0.254: R1.1 20.92,39.12 21.19,39.12 IC4.2 TFT2.20
TFT_SCLK
  Bottom 0.254: TFT2.17 23.41,32.1 24.76,30.75 36.07,30.75 42.04,36.72 42.04,43.69 38.35,47.37 CONN1.15 36.31,48.91 RPI1.S23
  Bottom 0.305: RPI1.S23 | RPI1.S23 RPI1.23
TXD
  Bottom 0.254: 12.19,50.67 12.19,48.77 11.96,48.54 11.18,47.75 11.18,46.61 10.54,45.97 8.76,45.97 CONN1.3
  Bottom 0.305: 12.19,50.67 12.19,51.94 12.76,52.51 14.54,52.51 15.96,53.9 | 15.96,53.9 RPI1.8 | RPI1.S8 15.99,53.93 15.96,53.9
VCC  (via drill 0.5)
  Top 0.406: NEOPIX.2 5.59,12.83 4.19,11.43 v4.06,11.43 | v60.83,13.97 59.69,12.83 SENSE.2
  Bottom 0.406: SJ1.2 7.75,13.21 5.97,11.43 v4.06,11.43 4.06,9.74 C34.1 5.4,9.71 13.59,1.52 47.37,1.52 50.16,4.32 56.58,4.32 57.78,5.52 57.78,10.92 v60.83,13.97
VMID
  Bottom 0.254: IC3.27 29.35,11.19 28.19,10.03
  Bottom 0.305: 28.19,10.03 25.59,10.03 24.95,9.4 C1.1
  Bottom 0.406: C1.1 23.07,9.3 C7.1

### Text on the board
tPlace: SDA | SCL | TX | RX | 4 | 17 | 18 | 27 | 22 | 23 | 24 | 25 | MO | MI | CL | C0 | C1 | 5 | 6 | 12 | 13 | 16 | 19 | 20 | 21 | Audio | ON | OFF | DotStar LEDs | Button | Left / Mic | Right / Mic | 5-Way Select | GPIO #12 | GPIO 13 | Right | 8Ω 1W / Speakers | Left | Head / phone
bPlace: FAN: / #4 | 1.54 ST7789 240x240 TFT / SPI, CE0, DC 25 / Backlight: 26 | 35 | Button: 17 / Joy Sel: 16, L 22 / U 23, R 24, D 27 / DotStars: D5, C6 | 3pin Volt | 3v | STEMMA QT / GND, 3V / SDA, SCL | I2S Digital Audio: 18,19,20,21